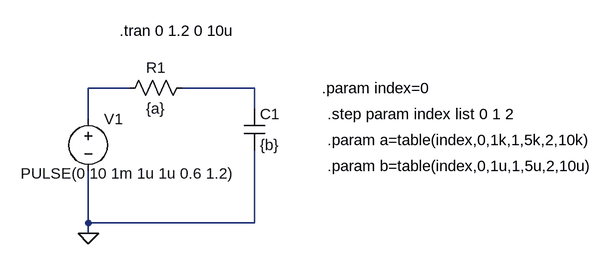
[diagram p0: schematic dobleparametro.asc]
dobleparametro.asc, the LTspice schematic file:
Version 4
SHEET 1 884 680
WIRE 112 176 48 176
WIRE 304 176 192 176
WIRE 304 208 304 176
WIRE 48 224 48 176
WIRE 48 384 48 304
WIRE 304 384 304 272
WIRE 304 384 48 384
WIRE 48 400 48 384
FLAG 48 400 0
SYMBOL res 208 160 R90
WINDOW 0 0 56 VBottom 2
WINDOW 3 32 56 VTop 2
SYMATTR InstName R1
SYMATTR Value {a}
SYMBOL cap 288 208 R0
SYMATTR InstName C1
SYMATTR Value {b}
SYMBOL voltage 48 208 R0
WINDOW 3 -104 100 Left 2
WINDOW 123 0 0 Left 0
WINDOW 39 0 0 Left 0
SYMATTR InstName V1
SYMATTR Value PULSE(0 10 1m 1u 1u 0.6 1.2)
TEXT 96 88 Left 2 !.tran 0 1.2 0 10u
TEXT 408 176 Left 2 !.param index=0
TEXT 416 216 Left 2 !.step param index list 0 1 2
TEXT 416 256 Left 2 !.param a=table(index,0,1k,1,5k,2,10k)
TEXT 416 296 Left 2 !.param b=table(index,0,1u,1,5u,2,10u)

The netlist it stands for:
* dobleparametro.asc
R1 N002 N001 {a}
C1 N002 0 {b}
V1 N001 0 PULSE(0 10 1m 1u 1u 0.6 1.2)
.tran 0 1.2 0 10u
.param index=0
.step param index list 0 1 2
.param a=table(index,0,1k,1,5k,2,10k)
.param b=table(index,0,1u,1,5u,2,10u)
.backanno
.end